# Altium project [ForFun]BalancingRobotonBall.PrjPCB
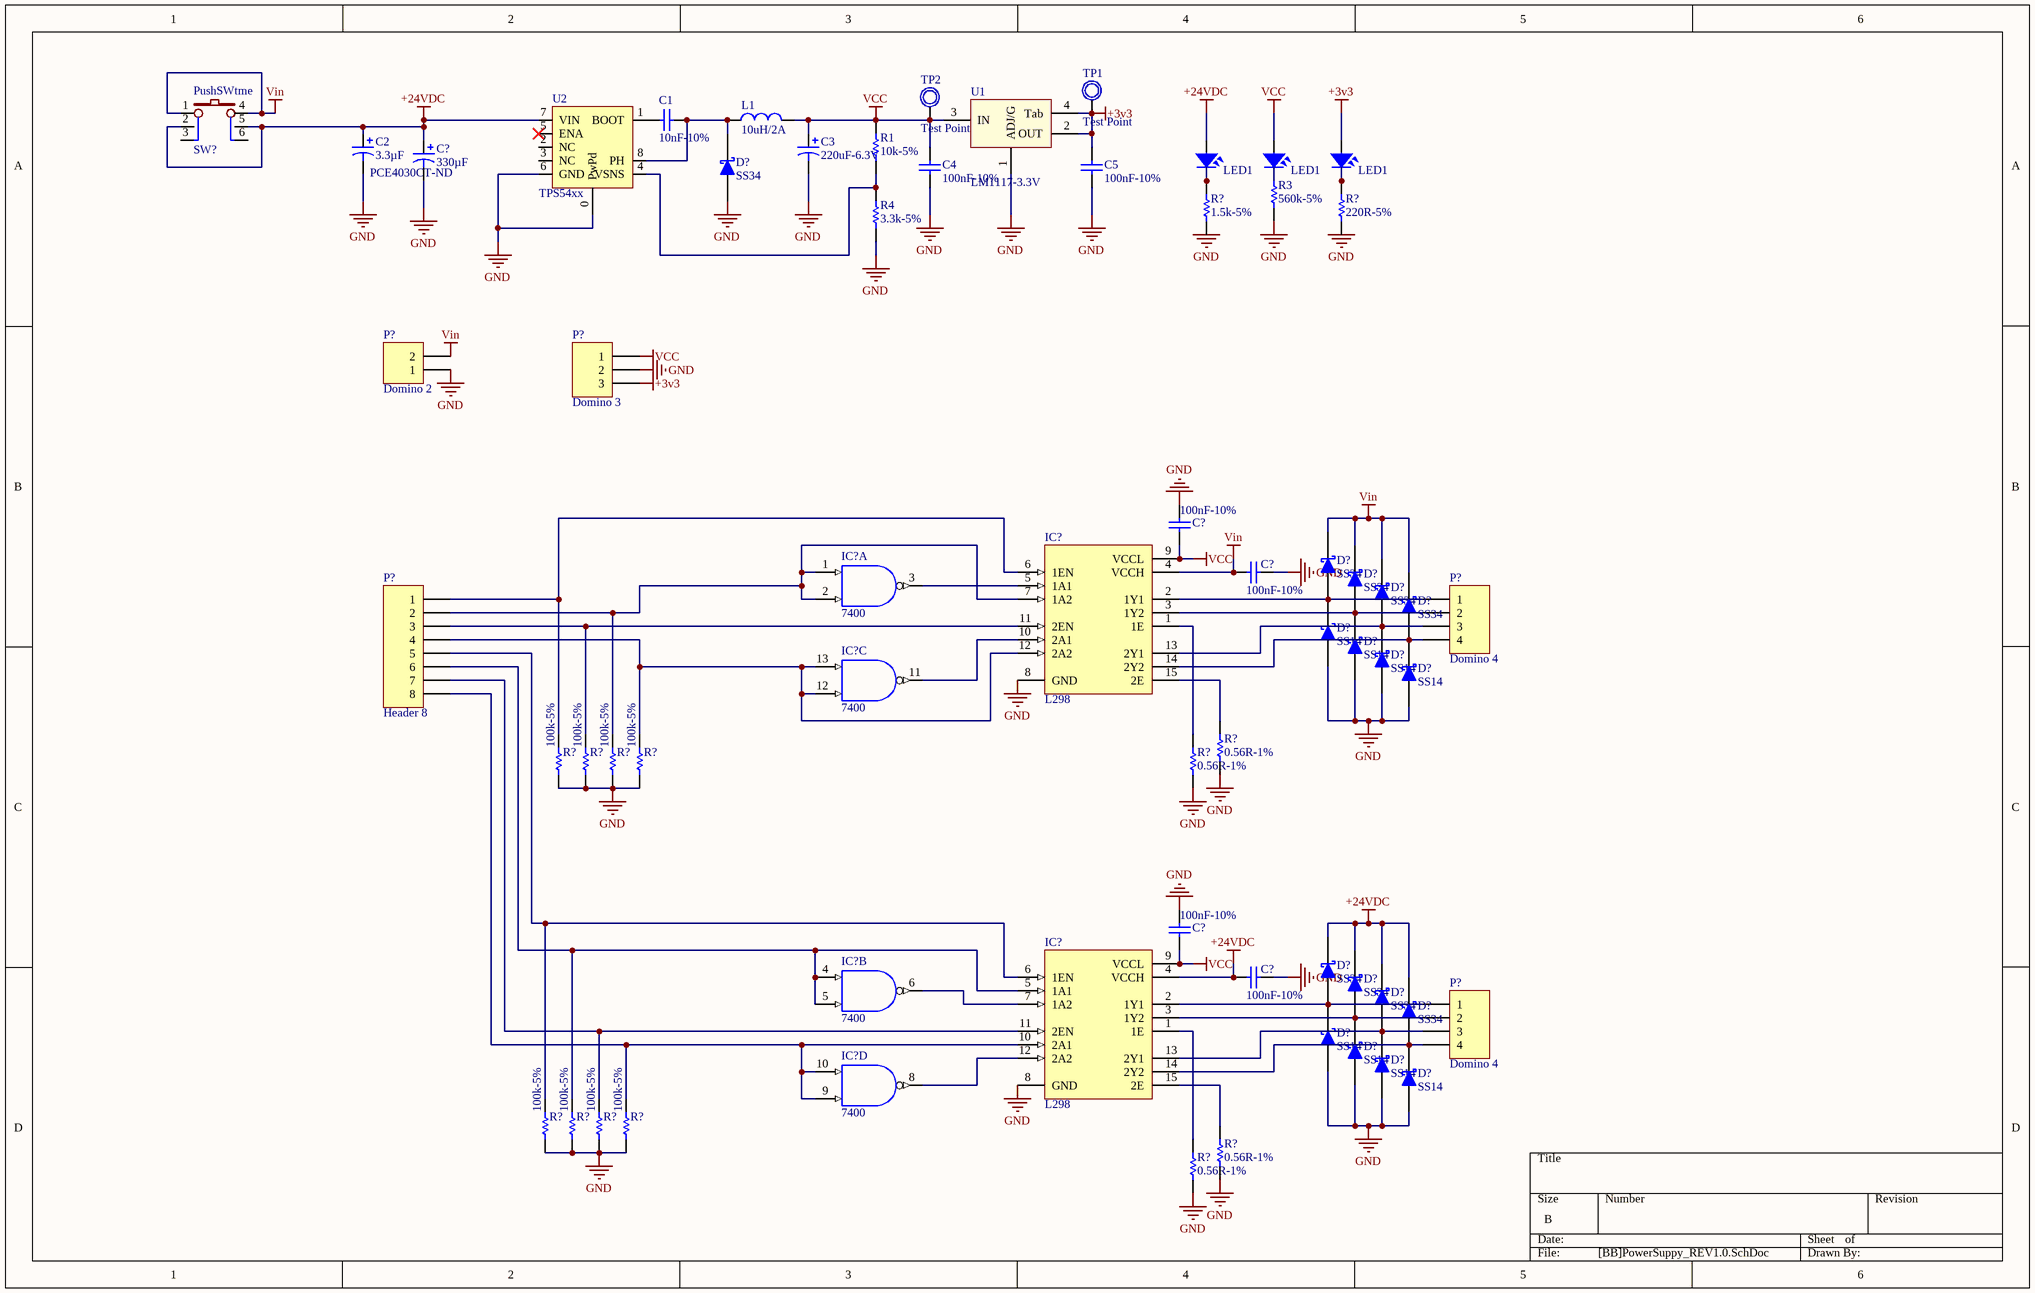
[diagram p0: [BB]PowerSuppy_REV1.0.SchDoc]
1 sheet, 64 parts. Net scope: global (net labels, ports and power ports of the same name join across sheets).
Board file: [ForFun]BalancingRobotonBall_REV1.0.PcbDoc

## Sheet [BB]PowerSuppy_REV1.0.SchDoc
size B

### Parts
(Parts that share a designator on the sheet are numbered #1, #2 ... from top to bottom, then left to right.)
C1  10nF-10%  [C0805]
C2  3.3µF  Supplier Part Number 1: PCE4030CT-ND  [SM/C_ALU_SA]
C3  220uF-6.3V  [SM/C_ALU_SD8]
C4  100nF-10%  [C0805]
C5  100nF-10%  [C0805]
C?#1  Capacitance: 330µF  (hidden comment: EEE-1VA331P)
C?#2  100nF-10%  [C0805]
C?#3  100nF-10%  [C0805]
C?#4  100nF-10%  [C0805]
C?#5  100nF-10%  [C0805]
D?#1  SS34  [DO-214AC (SMA)]
D?#2  SS34  [DO-214AC (SMA)]
D?#3  SS34  [DO-214AC (SMA)]
D?#4  SS34  [DO-214AC (SMA)]
D?#5  SS34  [DO-214AC (SMA)]
D?#6  SS14  [DO-214AC (SMA)]
D?#7  SS14  [DO-214AC (SMA)]
D?#8  SS14  [DO-214AC (SMA)]
D?#9  SS14  [DO-214AC (SMA)]
D?#10  SS34  [DO-214AC (SMA)]
D?#11  SS34  [DO-214AC (SMA)]
D?#12  SS34  [DO-214AC (SMA)]
D?#13  SS34  [DO-214AC (SMA)]
D?#14  SS14  [DO-214AC (SMA)]
D?#15  SS14  [DO-214AC (SMA)]
D?#16  SS14  [DO-214AC (SMA)]
D?#17  SS14  [DO-214AC (SMA)]
IC?#1  L298  [DIP15SL2]
IC?#2  7400  [SO14-150mil]  (part A of 4)
IC?#3  7400  [SO14-150mil]  (part C of 4)
IC?#4  L298  [DIP15SL2]
IC?#5  7400  [SO14-150mil]  (part B of 4)
IC?#6  7400  [SO14-150mil]  (part D of 4)
L1  10uH/2A  [L6D38]
LED1#1  LED SMD  [SM-LED-0805-Blue]  (value not drawn)
LED1#2  LED SMD  [SM-LED-0805-Blue]  (value not drawn)
LED1#3  LED SMD  [SM-LED-0805-Blue]  (value not drawn)
P?#1  Domino 3  [DOMINO SMALL 3]
P?#2  Domino 2  [DOMINO 2- 5mm]
P?#3  Header 8  [JP8]
P?#4  Domino 4  [DOMINO 4 -5mm]
P?#5  Domino 4  [DOMINO 4 -5mm]
PushSWtme  SW?  [PUSH SW]
R1  10k-5%  [R0805]
R3  560k-5%  [R0805]
R4  3.3k-5%  [R0805]
R?#1  1.5k-5%  [R0805]
R?#2  220R-5%  [R0805]
R?#3  0.56R-1%  [R0805]
R?#4  100k-5%  [R0805]
R?#5  100k-5%  [R0805]
R?#6  100k-5%  [R0805]
R?#7  100k-5%  [R0805]
R?#8  0.56R-1%  [R0805]
R?#9  100k-5%  [R0805]
R?#10  100k-5%  [R0805]
R?#11  100k-5%  [R0805]
R?#12  100k-5%  [R0805]
R?#13  0.56R-1%  [R0805]
R?#14  0.56R-1%  [R0805]
TP1  Test Point  [Hole 1.5mm]
TP2  Test Point  [Hole 1.5mm]
U1  LM1117-3.3V  [SOT223-4N]
U2  TPS54xx  [SOIC-8 POWERPAD]

### Nets
+3v3: C5.2 LED1#3.1 P?#1.3 TP1.0 U1.2(OUT) U1.4(Tab)
+24VDC: C2.1 C?#1.1 C?#5.2 D?#10.2(K) D?#11.2(K) D?#12.2(K) D?#13.2(K) IC?#4.4(VCCH) LED1#1.1 PushSWtme.2 PushSWtme.5 U2.7(VIN)
GND: C2.2 C3.2 C4.1 C5.1 C?#1.2 C?#2.2 C?#3.1 C?#4.2 C?#5.1 D?#1.1(A) D?#6.1(A) D?#7.1(A) D?#8.1(A) D?#9.1(A) D?#14.1(A) D?#15.1(A) D?#16.1(A) D?#17.1(A) IC?#1.8(GND) IC?#2.7(GND) IC?#3.7(GND) IC?#4.8(GND) IC?#5.7(GND) IC?#6.7(GND) P?#1.2 P?#2.1 R3.1 R4.1 R?#3.1 R?#4.1 R?#5.1 R?#6.1 R?#7.1 R?#8.1 R?#9.1 R?#10.1 R?#11.1 R?#12.1 R?#13.1 R?#14.1 U1.1(ADJ/G) U2.0(PwPd) U2.6(GND)
VCC: C3.1 C4.2 C?#2.1 C?#4.1 IC?#1.9(VCCL) IC?#2.14(VCC) IC?#3.14(VCC) IC?#4.9(VCCL) IC?#5.14(VCC) IC?#6.14(VCC) L1.2 LED1#2.1 P?#1.1 R1.2 TP2.0 U1.3(IN)
Vin: C?#3.2 D?#2.2(K) D?#3.2(K) D?#4.2(K) D?#5.2(K) IC?#1.4(VCCH) P?#2.2 PushSWtme.1 PushSWtme.4
NetC1_1: C1.1 U2.1(BOOT)
NetC1_2: C1.2 D?#1.2(K) L1.1 U2.8(PH)
NetD?#2_1: D?#2.1(A) D?#6.2(K) IC?#1.2(1Y1) P?#4.1
NetD?#3_1: D?#3.1(A) D?#7.2(K) IC?#1.3(1Y2) P?#4.2
NetD?#4_1: D?#4.1(A) D?#8.2(K) IC?#1.13(2Y1) P?#4.3
NetD?#5_1: D?#5.1(A) D?#9.2(K) IC?#1.14(2Y2) P?#4.4
NetD?#10_1: D?#10.1(A) D?#14.2(K) IC?#4.2(1Y1) P?#5.1
NetD?#11_1: D?#11.1(A) D?#15.2(K) IC?#4.3(1Y2) P?#5.2
NetD?#12_1: D?#12.1(A) D?#16.2(K) IC?#4.13(2Y1) P?#5.3
NetD?#13_1: D?#13.1(A) D?#17.2(K) IC?#4.14(2Y2) P?#5.4
NetIC?#1_1: IC?#1.1(1E) R?#8.2
NetIC?#1_5: IC?#1.5(1A1) IC?#2.3(~{O})
NetIC?#1_6: IC?#1.6(1EN) P?#3.1 R?#4.2
NetIC?#1_7: IC?#1.7(1A2) IC?#2.1(A) IC?#2.2(B) P?#3.2 R?#6.2
NetIC?#1_10: IC?#1.10(2A1) IC?#3.11(~{O})
NetIC?#1_11: IC?#1.11(2EN) P?#3.3 R?#5.2
NetIC?#1_12: IC?#1.12(2A2) IC?#3.12(B) IC?#3.13(A) P?#3.4 R?#7.2
NetIC?#1_15: IC?#1.15(2E) R?#3.2
NetIC?#4_1: IC?#4.1(1E) R?#14.2
NetIC?#4_5: IC?#4.5(1A1) IC?#5.4(A) IC?#5.5(B) P?#3.6 R?#10.2
NetIC?#4_6: IC?#4.6(1EN) P?#3.5 R?#9.2
NetIC?#4_7: IC?#4.7(1A2) IC?#5.6(~{O})
NetIC?#4_10: IC?#4.10(2A1) IC?#6.9(B) IC?#6.10(A) P?#3.8 R?#12.2
NetIC?#4_11: IC?#4.11(2EN) P?#3.7 R?#11.2
NetIC?#4_12: IC?#4.12(2A2) IC?#6.8(~{O})
NetIC?#4_15: IC?#4.15(2E) R?#13.2
NetLED1#1_2: LED1#1.2 R?#1.2
NetLED1#2_2: LED1#2.2 R3.2
NetLED1#3_2: LED1#3.2 R?#2.2
NetR1_1: R1.1 R4.2 U2.4(VSNS)

Not connected (* = marked no-connect by the designer): PushSWtme 3 6; R?#1 1; R?#2 1; U2 2(NC) 3(NC) 5(ENA)*

### Notes on the sheet
- Labels drawn without touching a wire or pin: GND

### Library data of the parts
C1 = 10nF-50V-C0805: Non-Polarized Capacitor; Manufacturer: Yageo; Manufacturer Part Number: CC0805KRX7R9BB103; Value: 10nF-10%; Digi-Key Part Number: 311-1136-1-ND; Unit Price: 0.1
C2 = 4.7uF-25V-Tantalum: Tantalum Capacitor; Manufacturer: Panasonic Electronic Components; Manufacturer Part Number: EEE-FC1V3R3R; Tolerance: ±20%; Voltage Rating: 35V; Lifetime @ Temp.: 1000 Hrs @ 105°C; Ripple Current: 45mA; Impedance: 3 Ohm; Surface Mount Land Size: 0.169" L x 0.169" W (4.30mm x 4.30mm); Supplier 1: Digi-Key; RoHS: RoHS Compliant; Category: Capacitors; Stock 1: 2931; Pricing 1: 1=0.46, 10=0.363, 25=0.306, 50=0.2622, 100=0.2185, 250=0.16388, 500=0.13984, 1000=0.10925 (USD); Packaging: Cut Tape (CT); Capacitance: 3.3µF; ESR (Equivalent Series Resistance): -; Operating Temperature: -40°C ~ 105°C; Type: -; Applications: AEC-Q200; Lead Spacing: -; Size / Dimension: 0.157" Dia (4.00mm); Height - Seated (Max): 0.213" (5.40mm); Mounting Type: Surface Mount; Package / Case: Radial, Can - SMD; ComponentLink1URL: http://industrial.panasonic.com/www-cgi/jvcr13pz.cgi?E+PZ+3+ABA0005+EEEFC1V3R3R+7+WW; ComponentLink1Description: http://industrial.panasonic.com/www-cgi/jvcr13pz.cgi?E+PZ+3+ABA0005+EEEFC1V3R3R+7+WW
C3 = 220uF-6.3V-Tantalum: Tantalum Capacitor; Manufacturer: AVX Corporation; Manufacturer Part Number: TAJC227K006RNJ; Value: 220uF-6.3V; Digi-Key Part Number: 478-1713-1-ND; Unit Price: 2.1
C4 C5 C?#2-C?#5 = 100nF-50V-C0805: Non-Polarized Capacitor; Manufacturer: Yageo; Manufacturer Part Number: CC0805KRX7R9BB104; Value: 100nF-10%; Digi-Key Part Number: 311-1140-1-ND; Unit Price: 0.1
C?#1 = 330uF-35V SMD Alu: CAP ALUM 330UF 20% 35V SMD; Manufacturer: Panasonic Electronic Components; Lifetime @ Temp.: 2000 Hrs @ 85°C; Type: Polar; Ripple Current: 350mA; Surface Mount Land Size: 0.406" L x 0.406" W (10.30mm x 10.30mm); Supplier 1: Digi-Key; Manufacturer Part Number: EEE-1VA331P; RoHS: RoHS Compliant; Category: Capacitors; Stock 1: 66804; Pricing 1: 1=0.96, 10=0.806, 25=0.6616, 50=0.5774, 100=0.5053, 250=0.397 (USD); Packaging: Cut Tape (CT); Tolerance: ±20%; Voltage Rating: 35V; ESR (Equivalent Series Resistance): -; Operating Temperature: -40°C ~ 85°C; Applications: General Purpose; Impedance: -; Lead Spacing: -; Size / Dimension: 0.394" Dia (10.00mm); Height - Seated (Max): 0.402" (10.20mm); Mounting Type: Surface Mount; Package / Case: Radial, Can - SMD; ComponentLink1URL: https://industrial.panasonic.com/cdbs/www-data/pdf/RDE0000/ABA0000C7.pdf; ComponentLink1Description: https://industrial.panasonic.com/cdbs/www-data/pdf/RDE0000/ABA0000C7.pdf; Supplier Part Number 1: PCE3959CT-ND
D?#1-D?#17 = Diode_SS14: DIODE SCHOTTKY 40V 1A DO214AC; Manufacturer: Vishay Semiconductor Diodes Division; Manufacturer Part Number: SS14-E3/61T; Digi-Key Part Number: SS14-E3/61TGITR-ND; Unit Price: 0.07981
IC?#1 IC?#4 = L298: Dual Full-H Driver; Note: The tab is elec is connected to GND pin; Published: 15-May-2002; DatasheetVersion: Jun-1990; PackageReference: KV015; Publisher: Altium Limited; PackageDescription: TO, Thru-Hole, Vertical, Heatsink Mounted; 15 Bent Staggered Leads; Pitch 1.27 mm; ComponentLink1Description: Manufacturer Link; ComponentLink1URL: http://www.ti.com/
IC?#2 IC?#3 IC?#5 IC?#6 = 7400: Quad 2-Input NAND Gate; Value: DIP14/W0.3; Value: 7400
L1 = L6D38-100M: 10uH/2A ±20% SMD 6.7x6.7x4mm Inductor; tme: http://tme.vn/Product.aspx?id=1877; Unit price: 6000 VND; Value: 10uH/2A
LED1#1-LED1#3 = LED-SMD-0805
P?#1 = Domino 3: Domino 3-Pin; LatestRevisionDate: 17-Jul-2002; LatestRevisionNote: Re-released for DXP Platform.; Publisher: Altium Limited
P?#2 = Domino 2: Domino, 2-Pin; LatestRevisionDate: 17-Jul-2002; LatestRevisionNote: Re-released for DXP Platform.; Publisher: Altium Limited
P?#3 = Header 8: Header, 8-Pin; LatestRevisionDate: 17-Jul-2002; LatestRevisionNote: Re-released for DXP Platform.; Publisher: Altium Limited
P?#4 P?#5 = Domino 4: Domino 4-Pin; LatestRevisionDate: 17-Jul-2002; LatestRevisionNote: Re-released for DXP Platform.; Publisher: Altium Limited
PushSWtme = PushSWtme: Push SW 8x8 mm latching ON/OFF
R1 = 10k-5%-R0805: RES 10k OHM 1/8W 5% 0805 SMD; Manufacturer: Yageo; Manufacturer Part Number: RC0805JR-0710KL; Digi-Key Part Number: 311-10KARTR-ND; Unit Price: 0.00209
R3 = 560k-5%-R0603: RES 560k OHM 1/10W 5% 0603 SMD; Manufacturer: Yageo; Manufacturer Part Number: RC0603JR-07560KL; Digi-Key Part Number: 311-560KGRTR-ND; Unit Price: 0.00131
R4 = 3.3k-5%-R0805: RES 3.3k OHM 1/8W 5% 0805 SMD; Manufacturer: Yageo; Manufacturer Part Number: RC0805JR-073K3L; Digi-Key Part Number: 311-3.3KARTR-ND; Unit Price: 0.00209
R?#1 = 1.5k-5%-R0805: RES 1.5k OHM 1/8W 5% 0805 SMD; Manufacturer: Yageo; Manufacturer Part Number: RC0805JR-071K5L; Digi-Key Part Number: 311-1.5KARTR-ND; Unit Price: 0.00209
R?#2 = 220R-5%-R0805: RES 220 OHM 1/8W 5% 0805 SMD; Manufacturer: Yageo; Manufacturer Part Number: RC0805JR-07220RL; Digi-Key Part Number: 311-220ARTR-ND; Unit Price: 0.00209
R?#3 R?#8 R?#13 R?#14 = 0.56R-1%-R0603: RES 0.56 OHM 1/10W 1% 0603 SMD; Manufacturer: Yageo; Manufacturer Part Number: RL0603FR-070R56L; Digi-Key Part Number: 311-.56QTR-ND; Unit Price: 0.03683
R?#4-R?#7 R?#9-R?#12 = 100k-5%-R0805: RES 100k OHM 1/8W 5% 0805 SMD; Manufacturer: Yageo; Manufacturer Part Number: RC0805JR-07100KL; Digi-Key Part Number: 311-100KARTR-ND; Unit Price: 0.00209
U1 = LM1117-3.3V: 800mA Low-Dropout Linear Regulator; Manufacturer: Texas Instruments; Manufacturer Part Number: LM1117MPX-3.3/NOPB; Digi-Key Part Number: LM1117MPX-3.3/NOPBTR-ND; Unit Price: 0.42700; tme link: http://tme.vn/Product.aspx?id=437; Unit price: 4000 VND
U2 = TPS54xx: IC REG BUCK ADJ 1A 8SOIC; Manufacturer: Texas Instruments; Manufacturer Part Number: TPS5410DR; Unit Price: 1.6; Digi-Key Part Number: 296-26982-2-ND
TP1 TP2 = Test Point: Value: Test Point